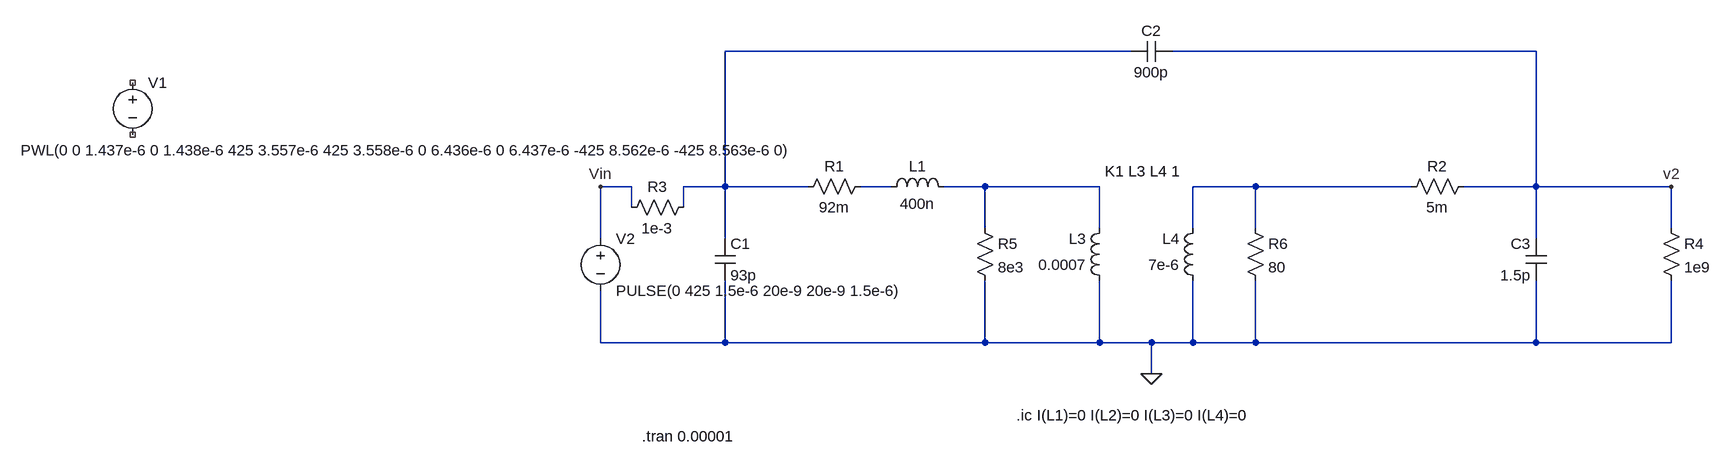
[diagram p0: schematic PlanarTransformer_Trans.asc]
PlanarTransformer_Trans.asc, the LTspice schematic file:
Version 4.1
SHEET 1 2512 1248
WIRE 464 -192 -160 -192
WIRE 1088 -192 528 -192
WIRE -304 16 -352 16
WIRE -160 16 -160 -192
WIRE -160 16 -224 16
WIRE -32 16 -160 16
WIRE 96 16 48 16
WIRE 240 16 176 16
WIRE 416 16 240 16
WIRE 656 16 560 16
WIRE 896 16 656 16
WIRE 1088 16 1088 -192
WIRE 1088 16 976 16
WIRE 1296 16 1088 16
WIRE -304 48 -304 16
WIRE -224 48 -224 16
WIRE 240 80 240 16
WIRE 416 80 416 16
WIRE 560 80 560 16
WIRE 656 80 656 16
WIRE 1296 80 1296 16
WIRE -352 96 -352 16
WIRE -160 96 -160 16
WIRE 1088 96 1088 16
WIRE -352 256 -352 176
WIRE -160 256 -160 160
WIRE -160 256 -352 256
WIRE 240 256 240 160
WIRE 240 256 -160 256
WIRE 416 256 416 160
WIRE 416 256 240 256
WIRE 496 256 416 256
WIRE 560 256 560 160
WIRE 560 256 496 256
WIRE 656 256 656 160
WIRE 656 256 560 256
WIRE 1088 256 1088 160
WIRE 1088 256 656 256
WIRE 1296 256 1296 160
WIRE 1296 256 1088 256
WIRE 496 304 496 256
FLAG 1296 16 v2
FLAG -352 16 Vin
FLAG 496 304 0
SYMBOL voltage -1072 -160 R0
WINDOW 123 24 44 Left 2
WINDOW 39 0 0 Left 0
WINDOW 3 -172 120 Left 2
SYMATTR Value PWL(0 0 1.437e-6 0 1.438e-6 425 3.557e-6 425 3.558e-6 0 6.436e-6 0 6.437e-6 -425 8.562e-6 -425 8.563e-6 0)
SYMATTR InstName V1
SYMBOL res 64 0 R90
WINDOW 0 0 56 VBottom 2
WINDOW 3 32 56 VTop 2
SYMATTR InstName R1
SYMATTR Value 92m
SYMBOL res 992 0 R90
WINDOW 0 0 56 VBottom 2
WINDOW 3 32 56 VTop 2
SYMATTR InstName R2
SYMATTR Value 5m
SYMBOL ind 432 176 R180
WINDOW 0 36 80 Left 2
WINDOW 3 36 40 Left 2
SYMATTR InstName L3
SYMATTR Value 0.0007
SYMATTR Type ind
SYMBOL ind 576 176 R180
WINDOW 0 36 80 Left 2
WINDOW 3 36 40 Left 2
SYMATTR InstName L4
SYMATTR Value 7e-6
SYMATTR Type ind
SYMBOL ind 80 32 R270
WINDOW 0 32 56 VTop 2
WINDOW 3 5 56 VBottom 2
SYMATTR InstName L1
SYMATTR Value 400n
SYMBOL cap -176 96 R0
SYMATTR InstName C1
SYMATTR Value 93p
SYMBOL cap 528 -208 R90
WINDOW 0 0 32 VBottom 2
WINDOW 3 32 32 VTop 2
SYMATTR InstName C2
SYMATTR Value 900p
SYMBOL cap 1104 160 R180
WINDOW 0 24 56 Left 2
WINDOW 3 24 8 Left 2
SYMATTR InstName C3
SYMATTR Value 1.5p
SYMBOL res 1280 64 R0
SYMATTR InstName R4
SYMATTR Value 1e9
SYMBOL res 224 64 R0
SYMATTR InstName R5
SYMATTR Value 8e3
SYMBOL res 640 64 R0
SYMATTR InstName R6
SYMATTR Value 80
SYMBOL voltage -352 80 R0
WINDOW 123 0 0 Left 0
WINDOW 39 0 0 Left 0
SYMATTR InstName V2
SYMATTR Value PULSE(0 425 1.5e-6 20e-9 20e-9 1.5e-6)
SYMBOL res -208 32 R90
WINDOW 0 0 56 VBottom 2
WINDOW 3 32 56 VTop 2
SYMATTR InstName R3
SYMATTR Value 1e-3
TEXT 424 -8 Left 2 !K1 L3 L4 1
TEXT 288 368 Left 2 !.ic I(L1)=0 I(L2)=0 I(L3)=0 I(L4)=0
TEXT -288 400 Left 2 !.tran 0.00001

The netlist it stands for:
* PlanarTransformer_Trans.asc
V1 NC_01 NC_02 PWL(0 0 1.437e-6 0 1.438e-6 425 3.557e-6 425 3.558e-6 0 6.436e-6 0 6.437e-6 -425 8.562e-6 -425 8.563e-6 0)
R1 N002 N001 92m
R2 v2 N004 5m
L3 0 N003 0.0007
L4 0 N004 7e-6
L1 N002 N003 400n
C1 N001 0 93p
C2 v2 N001 900p
C3 0 v2 1.5p
R4 v2 0 1e9
R5 N003 0 8e3
R6 N004 0 80
V2 Vin 0 PULSE(0 425 1.5e-6 20e-9 20e-9 1.5e-6)
R3 N001 Vin 1e-3
K1 L3 L4 1
.ic I(L1)=0 I(L2)=0 I(L3)=0 I(L4)=0
.tran 0.00001
.backanno
.end